# EAGLE schematic untitled (EAGLE 9.5.2)
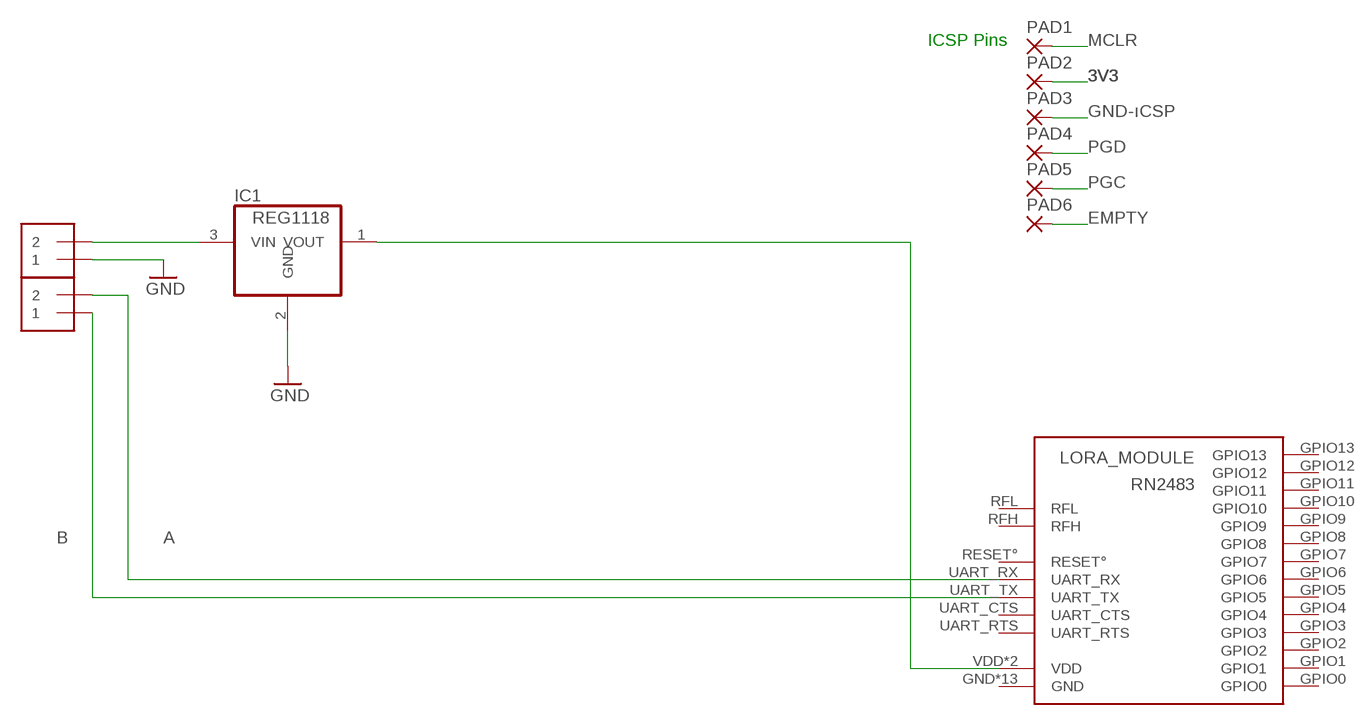
[diagram p0: schematic, sheet 1]

## Parts
IC1  REG1118  [SOT223]
J1  1X2-3.5MM  [1X2-3.5MM]
J2  1X2-3.5MM  [1X2-3.5MM]
LORA_MODULE  RN2483  [RN2483]
PAD1  1,6/0,8  [1,6/0,8]
PAD2  1,6/0,8  [1,6/0,8]
PAD3  1,6/0,8  [1,6/0,8]
PAD4  1,6/0,8  [1,6/0,8]
PAD5  1,6/0,8  [1,6/0,8]
PAD6  1,6/0,8  [1,6/0,8]

## Nets
3V3: PAD2.1(P)
A: J2.2 LORA_MODULE.UART_RX
B: J2.1 LORA_MODULE.UART_TX
EMPTY: PAD6.1(P)
GND: IC1.2(GND) J1.1
GND-ıCSP: PAD3.1(P)
MCLR: PAD1.1(P)
N$1: IC1.3(VIN) J1.2
N$2: IC1.1(VOUT) LORA_MODULE.VDD LORA_MODULE.VDD2(VDD)
PGC: PAD5.1(P)
PGD: PAD4.1(P)
Unconnected: LORA_MODULE.GND LORA_MODULE.GND1(GND) LORA_MODULE.GND2(GND) LORA_MODULE.GND3(GND) LORA_MODULE.GND4(GND) LORA_MODULE.GND5(GND) LORA_MODULE.GND6(GND) LORA_MODULE.GND7(GND) LORA_MODULE.GND8(GND) LORA_MODULE.GND9(GND) LORA_MODULE.GND10(GND) LORA_MODULE.GND11(GND) LORA_MODULE.GND12(GND) LORA_MODULE.GPIO0 LORA_MODULE.GPIO1 LORA_MODULE.GPIO2 LORA_MODULE.GPIO3 LORA_MODULE.GPIO4 LORA_MODULE.GPIO5 LORA_MODULE.GPIO6 LORA_MODULE.GPIO7 LORA_MODULE.GPIO8 LORA_MODULE.GPIO9 LORA_MODULE.GPIO10 LORA_MODULE.GPIO11 LORA_MODULE.GPIO12 LORA_MODULE.GPIO13 LORA_MODULE.RESET° LORA_MODULE.RFH LORA_MODULE.RFL LORA_MODULE.UART_CTS LORA_MODULE.UART_RTS

## Notes on the sheet
- ICSP Pins

## Library data of the parts
IC1 = burr-brown:REG1118: 800mA Low Dropout (LDO) Positive Regulator with Current Source and Sink Capability; MPN: REG1118-2.85/2K5G4; OC_FARNELL: unknown; OC_NEWARK: 14M2185
J1 J2 = adafruit:1X2: 3.5mm Terminal block http://www.ladyada.net/library/pcb/eaglelibrary.html
LORA_MODULE = tobias:RN2483: RN2483 Microchip Low-Power Lora Transceiver Module NOT TESTED There are testpads on the bottom of the device. The mask is supposed to cover that, but I have not tested it in practice yet. Info: http://www.microchip.com/wwwproducts/Devices.aspx?product=RN2483 Datasheet: http://ww1.microchip.com/downloads/en/DeviceDoc/50002346B.pdf Adapted from: https://github.com/Octanis1/Octanis1-Electronics/blob/ae493cac28c100e20856abe563dfe8824e9cc4bd/lib/Octanis1.lbr
PAD1-PAD6 = wirepad:1,6/0,8: THROUGH-HOLE PAD